# Altium schematic sheet Connector_CU Schematic.SchDoc: Title
size A3; ApprovalDate: dd/mm/yyyy; PartName: RFID_P5 CU board; PageSetup: Record=PageOptions|CenterHorizontal=True|CenterVertical=True|PrintScale=1.01|XCorrection=1.00|YCorrection=1.00|PrintKind=1|BorderSize=5000000|LeftOffset=0|BottomOffset=0|Orientation=2|PaperLength=1000|PaperWidth=1000|Scale=100|PaperSource=7|PrintQuality=600|MediaType=1|DitherType=10|PaperKind=A3 (297 x 420mm)|PrintScaleMode=1; Title2: Connector_CU Schematic; Date: *******; ApprovedBy: *******; CheckedBy: None; Author: *******; CompanyName: *******; DrawnBy: Name; Engineer: *******; Organization: *******; Address1: *******; Address2: *******; Address3: *******; Address4: *******; DocumentNumber: Doc Num; Revision: *******; SheetNumber: 1; SheetTotal: *******; CurrentTime: *******; CurrentDate: *******; Time: *******; DocumentFullPathAndName: *******; DocumentName: *******; ModifiedDate: *******; ImagePath: *******; ProjectName: *******; Application_BuildNumber: *******
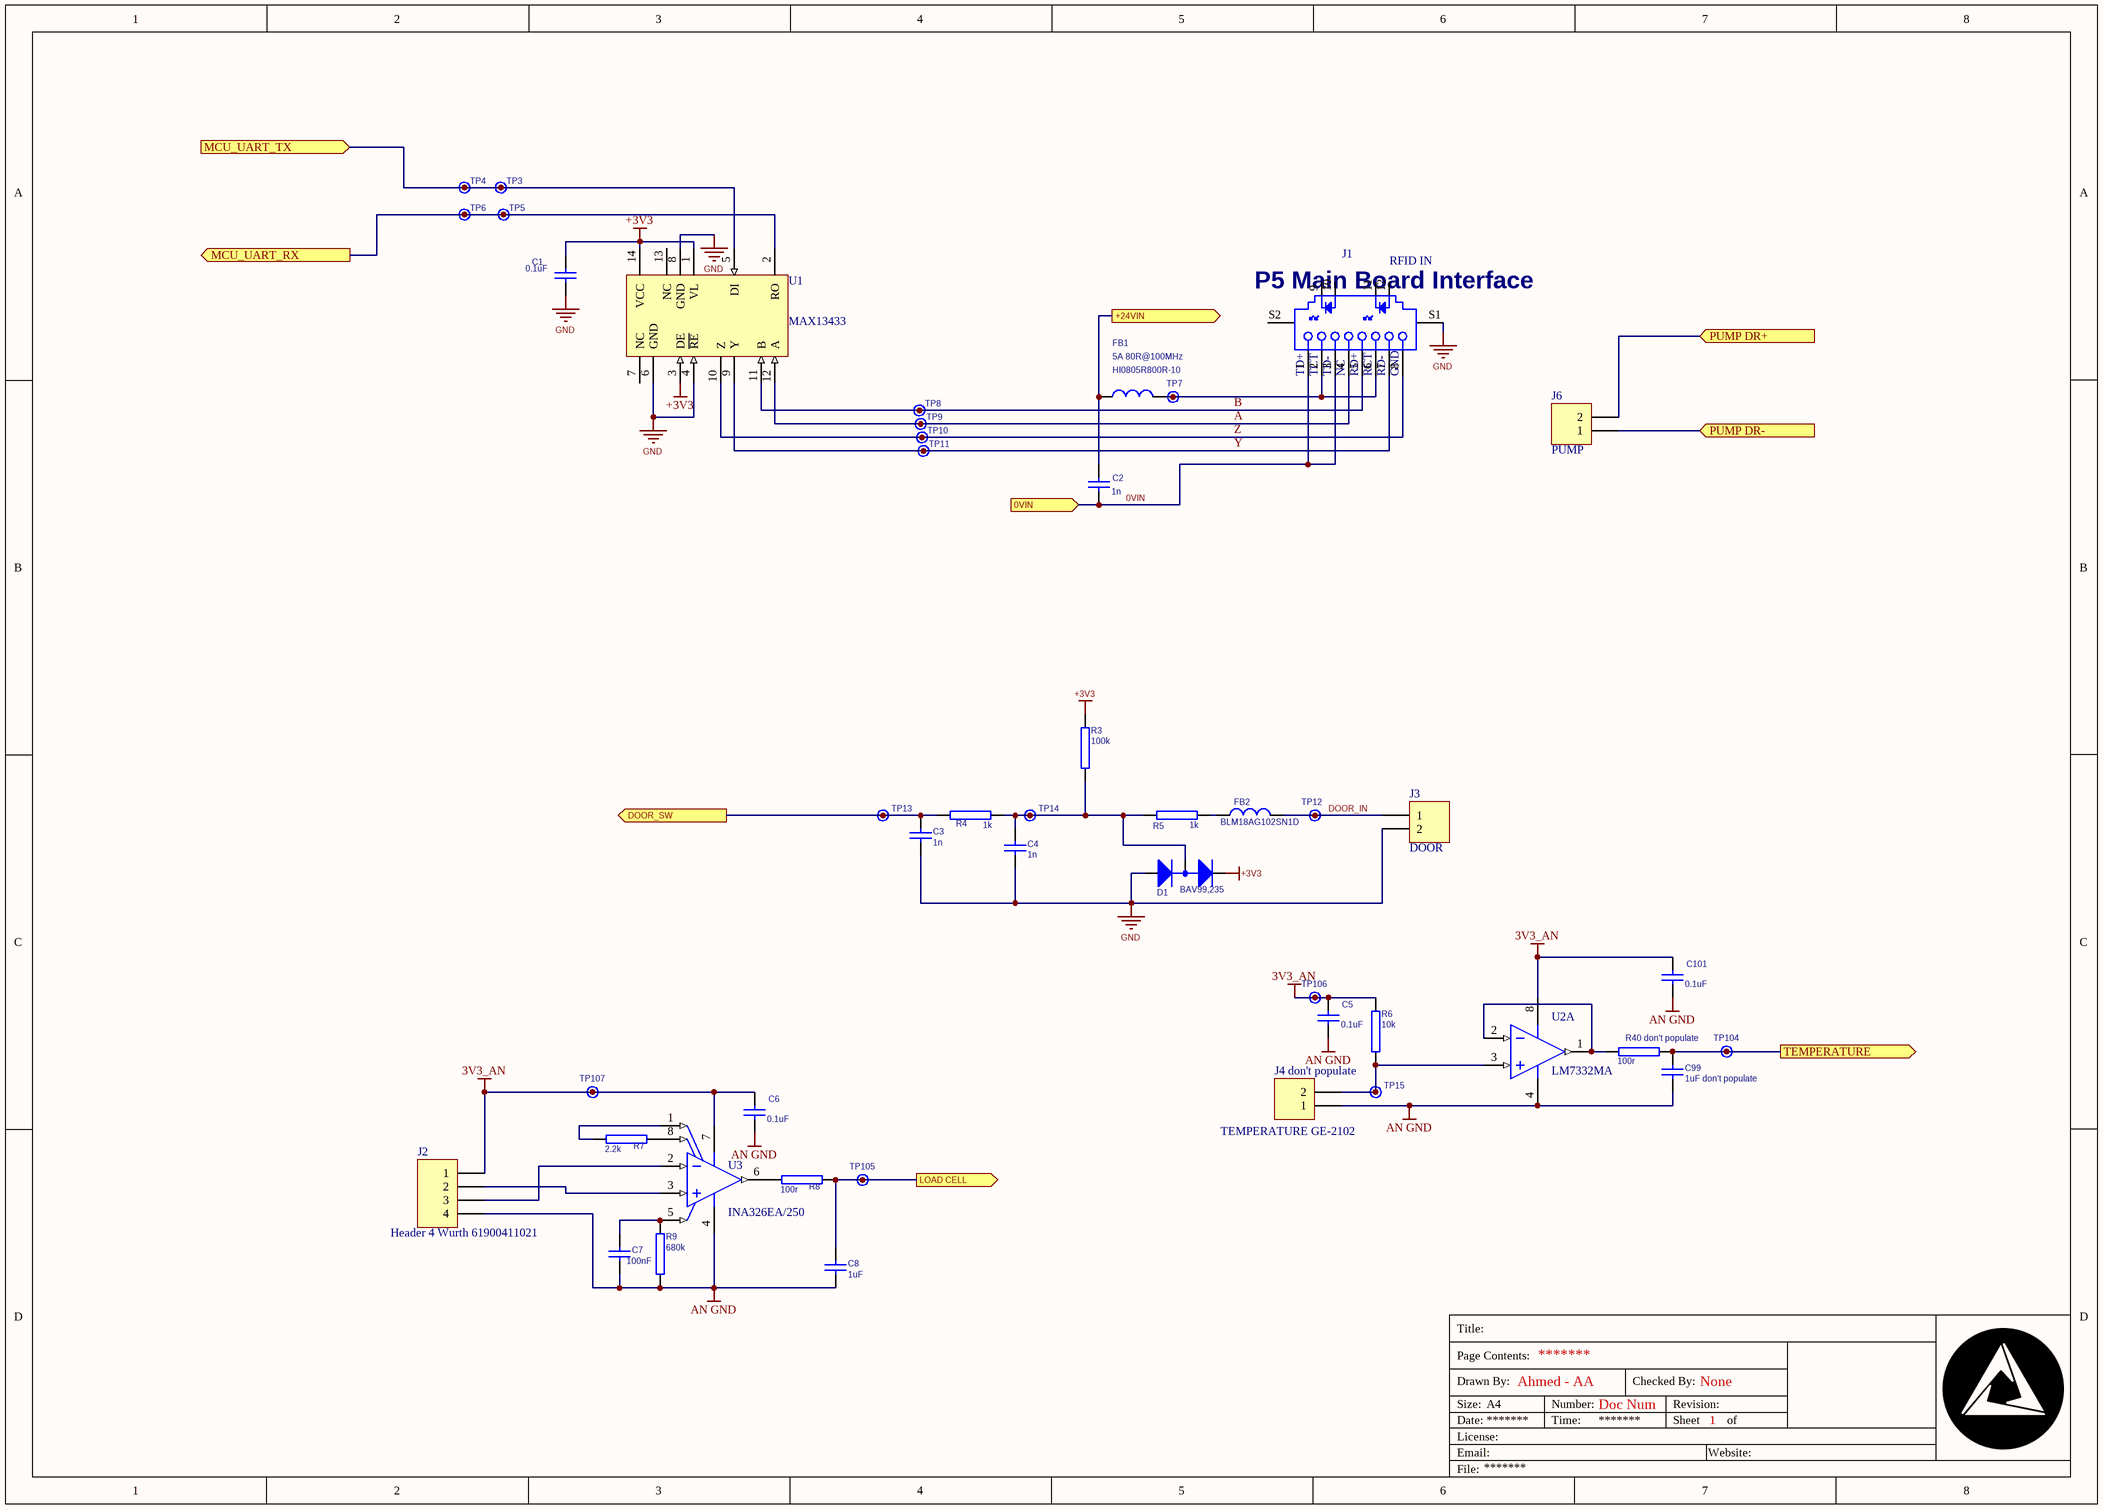
[diagram p0: Connector_CU Schematic.SchDoc]

## Parts
C1  0.1uF  [CAPC1608X09N(0603)]
C2  1n  [CAPC1608X09N(0603)]
C3  1n  [CAPC1608X09N(0603)]
C4  1n  [CAPC1608X09N(0603)]
C5  0.1uF  [CAPC1608X09N(0603)]
C6  0.1uF  [CAPC1608X09N(0603)]
C7  100nF  [CAPC1608X09N(0603)]
C8  1uF  [CAPC1608X09N(0603)]
C99  1uF don't populate  [CAPC1608X09N(0603)]
C101  0.1uF  [CAPC1608X09N(0603)]
D1  BAV99,235  [SOT95P240X130-3N (SOT23-3) DUAL DIODE A_KA_K]
FB1  5A 80R@100MHz  [RESC2012X06N(0805)]
FB2  400mA 1kohm@100MHz  [RESC1608X06N]  (value not drawn)
J1  RFID IN  [AMPH-RJHSE-5381_V]
J2  Header 4 Wurth 61900411021  [S04B-XASS-1N-BN]
J3  DOOR  [S02B-XASS-1]
J4_don't_populate  TEMPERATURE GE-2102  [S02B-XASS-1]
J6  PUMP  [S02B-XASS-1]
R3  100k  [RESC1608X06N(0603)]
R4  1k  [RESC1608X06N(0603)]
R5  1k  [RESC1608X06N(0603)]
R6  10k  [RESC1608X06N(0603)]
R7  2.2k  [RESC1608X06N(0603)]
R8  100r  [RESC1608X06N(0603)]
R9  680k  [RESC1608X06N(0603)]
R40_don't_populate  100r  [RESC1608X06N(0603)]
TP3  LFX_P  [Test Point 1mm]  (value not drawn)  (no BOM)
TP4  LFX_P  [Test Point 1mm]  (value not drawn)  (no BOM)
TP5  LFX_P  [Test Point 1mm]  (value not drawn)  (no BOM)
TP6  LFX_P  [Test Point 1mm]  (value not drawn)  (no BOM)
TP7  LFX_P  [Test Point 1mm]  (value not drawn)  (no BOM)
TP8  LFX_P  [Test Point 1mm]  (value not drawn)  (no BOM)
TP9  LFX_P  [Test Point 1mm]  (value not drawn)  (no BOM)
TP10  LFX_P  [Test Point 1mm]  (value not drawn)  (no BOM)
TP11  LFX_P  [Test Point 1mm]  (value not drawn)  (no BOM)
TP12  LFX_P  [Test Point 1mm]  (value not drawn)  (no BOM)
TP13  LFX_P  [Test Point 1mm]  (value not drawn)  (no BOM)
TP14  LFX_P  [Test Point 1mm]  (value not drawn)  (no BOM)
TP15  LFX_P  [Test Point 1mm]  (value not drawn)  (no BOM)
TP104  LFX_P  [Test Point 1mm]  (value not drawn)  (no BOM)
TP105  LFX_P  [Test Point 1mm]  (value not drawn)  (no BOM)
TP106  LFX_P  [Test Point 1mm]  (value not drawn)  (no BOM)
TP107  LFX_P  [Test Point 1mm]  (value not drawn)  (no BOM)
U1  MAX13433  [S14_M]
U2  LM7332MA  [M08A_N]  (part A of 2)
U3  INA326EA/250  [DGK0008A_L]

## Ports
0VIN (in), +24VIN (out), DOOR_SW (out), LOAD CELL (out), MCU_UART_RX (out), MCU_UART_TX (in), PUMP DR+ (in), PUMP DR- (in), TEMPERATURE (out)

## Nets
3V3_AN: C5.2 C6.2 C101.2 J2.1 R6.2 TP106.TP TP107.TP U2.8(V+) U3.7(V+)
+3V3: C1.2 D1.K2 R3.2 U1.1(VL) U1.3(DE) U1.14(VCC)
AN GND: C5.1 C6.1 C7.2 C8.2 C99.2 C101.1 J2.4 J4_don't_populate.1 R9.1 U2.4(V-) U3.4(V-)
GND: C1.1 C3.2 C4.2 D1.A1 J1.S1 J3.2 U1.4(~{RE}) U1.6(GND) U1.8(GND)
0VIN: C2.1 J1.1 J1.3 ; port 0VIN
+24VIN: C2.2 FB1.1 ; port +24VIN
A: J1.4 TP9.TP U1.12(A)
B: J1.5 TP8.TP U1.11(B)
DOOR_IN: FB2.2 J3.1 TP12.TP
DOOR_SW: C3.1 R4.2 TP13.TP ; port DOOR_SW
LOAD CELL: C8.1 R8.2 TP105.TP ; port LOAD CELL
MCU_UART_RX: TP5.TP TP6.TP U1.2(RO) ; port MCU_UART_RX
MCU_UART_TX: TP3.TP TP4.TP U1.5(DI) ; port MCU_UART_TX
PUMP DR+: J6.2 ; port PUMP DR+
PUMP DR-: J6.1 ; port PUMP DR-
TEMPERATURE: C99.1 R40_don't_populate.2 TP104.TP ; port TEMPERATURE
Y: J1.7 TP11.TP U1.9(Y)
Z: J1.8 TP10.TP U1.10(Z)
NetC4_1: C4.1 D1.K1A2 R3.1 R4.1 R5.2 TP14.TP
NetC7_1: C7.1 R9.2 U3.5(R2)
NetFB1_2: FB1.2 J1.2 J1.6 TP7.TP
NetFB2_1: FB2.1 R5.1
NetJ2_2: J2.2 U3.3(VIN+)
NetJ2_3: J2.3 U3.2(VIN-)
NetJ4_don't_populate_2: J4_don't_populate.2 R6.1 TP15.TP U2.3(INA+)
NetR7_1: R7.1 U3.1(R1)
NetR7_2: R7.2 U3.8(R1)
NetR8_1: R8.1 U3.6(VO)
NetR40_don't_populate_1: R40_don't_populate.1 U2.1(OUTA) U2.2(INA-)

Not connected (* = marked no-connect by the designer): J1 9 10 11 12 S2; U1 7(NC) 13(NC)

## Notes on the sheet
- (near J1) P5 Main Board Interface
- Title:
- Drawn By:
- Page Contents:
- Ahmed - AA
- Checked By:
- Size:
- Date:
- File:
- License:
- Email:
- A4
- Number:
- Time:
- Revision:
- Sheet
- Website:
- of
- (in symbol CMP-2000-06980-1) TD+; TCT; TD-; NC; RD+; RCT; RD-; GND

## Library data of the parts
C1 = GQM1885C1H100JB01D: Capacitor, Ceramic, 50V, ±5%, NP0, -55°C to 125°C; 08 Manufacturer: Murata Electronics North America; 06 Package: 0603; 12 Author: M.Fineschi; 05 Footprint Type: SMD; 02 Part Number: GQM1885C1H100JB01D; 03 Description: Capacitor, Ceramic, 50V, ±5%, NP0, -55°C to 125°C; 04 Value: 0.1uF; 01 Part Category: Capacitor; 09 Digikey PN: 490-3570-1-ND; ComponentLink1Description: Datasheet; ComponentLink1URL: L:\Datasheet\Capacitor\c02e.pdf
C2-C4 C8 C99 = GRM1885C1H102JA01D: Capacitor, Ceramic, 50V, ±5%, C0G NP0, -55°C to 125°C; 08 Manufacturer: Murata Electronics North America; 06 Package: 0603; 12 Author: D.Grace; 05 Footprint Type: SMD; 02 Part Number: GRM1885C1H102JA01D; 03 Description: Capacitor, Ceramic, 50V, ±5%, C0G NP0, -55°C to 125°C; 01 Part Category: Capacitor; 09 Digikey PN: 490-1451-2-ND; ComponentLink1Description: Datasheet; ComponentLink1URL: L:\Datasheet\Capacitor\c02e.pdf
  C2-C4: 04 Value: 1n
  C8 C99: 04 Value: 1uF
C5 C6 C101 = GRM188R71H104KA93D: Capacitor, Ceramic, 50V, ±10%, X7R, -55°C to 125°C; 08 Manufacturer: Murata Electronics North America; 04 Value: 100n; 06 Package: 0603; 12 Author: D.Grace; 05 Footprint Type: SMD; 02 Part Number: GRM188R71H104KA93D; 03 Description: Capacitor, Ceramic, 50V, ±10%, X7R, -55°C to 125°C; 01 Part Category: Capacitor; 09 Digikey PN: 490-1519-2-ND; ComponentLink1Description: Datasheet; ComponentLink1URL: L:\Datasheet\Capacitor\c02e.pdf
C7 = GRM1885C1H102JA01D: Capacitor, Ceramic, 50V, ±5%, C0G NP0, -55°C to 125°C; 08 Manufacturer: Murata Electronics North America; 04 Value: 1n; 06 Package: 0603; 12 Author: D.Grace; 05 Footprint Type: SMD; 02 Part Number: GRM1885C1H102JA01D; 03 Description: Capacitor, Ceramic, 50V, ±5%, C0G NP0, -55°C to 125°C; 01 Part Category: Capacitor; 09 Digikey PN: 490-1451-2-ND; ComponentLink1Description: Datasheet; ComponentLink1URL: L:\Datasheet\Capacitor\c02e.pdf
D1 = BAV99,235: Diodes, Vr = 100V, Io = 215mA, Vf = 1.25V, Tr = 4ns; 01 Part Category: Discreet; 08 Manufacturer: Fairchild Semiconductor; 06 Package: SOT-23-3; 12 Author: D.Grace; 05 Footprint Type: SMD; 02 Part Number: BAV99,235; 03 Description: Diodes, Vr = 100V, Io = 215mA, Vf = 1.25V, Tr = 4ns; 04 Value: BAV99,235; 09 Digikey PN: 568-5005-2-ND; ComponentLink1Description: Datasheet; ComponentLink1URL: L:\Datasheet\Discrete\BAV99_SER.pdf
FB1 = HI0805R800R-10: Ferrite Bead, 80 Ohm @ 100MHz, 5A, DC 10 mOhm Max, -55 °C to 125°C; 01 Part Category: Filter; 08 Manufacturer: Laird-Signal Integrity Products; 06 Package: 0805; 05 Footprint Type: SMD; 12 Author: L.Liu; 03 Description: Ferrite Bead, 80 Ohm @ 100MHz, 5A, DC 10 mOhm Max, -55 °C to 125°C; 04 Value: 80R@100MHz; ComponentLink1Description: Datasheet; ComponentLink1URL: I:\Engineering\Library\Datasheet\Filter\FerriteEMI_ChipBeads_br.pdf; 09 Digikey PN: 240-2395-2-ND; 02 Part Number: HI0805R800R-10
FB2 = BLM18AG102SN1D: Ferrite Bead, 1kohm@100MHz, 400mA, 500mohm, -55 to 125C; 01 Part Category: Filter; 08 Manufacturer: Murata; 06 Package: 0603; 05 Footprint Type: SMD; 12 Author: M.Fineschi; 02 Part Number: BLM18AG102SN1D; 03 Description: Ferrite Bead, 1kohm@100MHz, 400mA, 500mohm, -55 to 125C; 04 Value: 1kohm@100MHz; ComponentLink1Description: Datasheet; ComponentLink1URL: L:\Datasheet\Filter\L0110S0100BLM18A.pdf; 09 Digikey PN: 490-1015-2-ND; 10 Alternate Supplier: BLM18AG102SN1D
J1 = CMP-2000-06980-1: High Speed RJ45, Modular Jack, 8 Position, 8 Contacts, Shielded, with LEDs, -55 to 85 degC,12-Pin THD, RoHS, Tray; Manufacturer: Amphenol; Number of Positions/Contacts: 8p8c(RJ45,Ethernet); Number of Ports: 1; Catalog Drawings: RJ45SeriesRightAngle; PCN Design/Specification: MultipleSeriesCopper29/Jan/2009RJHSEShieldMaterial30/Jun/2015; Other Names: RJHSE5381; Online Catalog: RJHSESeries; Featured Product: ModularJacksProductSolutions; Tab Direction: Up; Shielding: Shielded,EMIFinger; LED Color: Yellow-Green; 3D Model: RJHSE538x.stpRJHSE538x.igs; Category: Connectors,Interconnects; Termination: Solder; Housing Material: Thermoplastic; Mounting Type: ThroughHole; Family: ModularConnectors-Jacks; Orientation: 90°Angle(Right); Features: BoardLock; Contact Material: PhosphorBronze; Mounting Technology: ThroughHole; Number of Rows: 1; Standard Package: 120; Ratings: -; Operating Temperature: -55°C~85°C; Series: RJHSE; Contact Finish: Gold; Package Reference: RJHSE-5381; Ingress Protection: -; Package Description: 12-Pin Through Hole Device, Body 16.51 x 15.75 mm; Contact Finish Thickness: 50µin(1.27µm); Datasheet URL: https://datasheet.ciiva.com/16481/rjhse538x-16481714.pdf; Datasheet Version: Rev. K, 04/2014; Connector Type: Jack; Manufacturer URL: http://www.amphenol.com/; Packaging: Tray
J2 = Header 4: Header, 4-Pin; LatestRevisionDate: 17-Jul-2002; LatestRevisionNote: Re-released for DXP Platform.; Publisher: Altium Limited
J3 J4_don't_populate J6 = Header 2: Header, 2-Pin; LatestRevisionDate: 17-Jul-2002; LatestRevisionNote: Re-released for DXP Platform.; Publisher: Altium Limited
R3 = RC0603FR-07100KL: Resistor, Thick Film, 0.1W, ±1%, ±100ppm/°C; 08 Manufacturer: Yageo; 13 Reviewed By: P.Moutzouris; 06 Package: 0603; 12 Author: D.Grace; 05 Footprint Type: SMD; 02 Part Number: RC0603FR-07100KL; 03 Description: Resistor, Thick Film, 0.1W, ±1%, ±100ppm/°C; 04 Value: 100k; 09 Digikey PN: 311-100KHRTR-ND; 01 Part Category: Resistor; ComponentLink1Description: Datasheet; ComponentLink1URL: L:\Datasheet\Resistor\PYu-RC0603_51_RoHS_L_4.pdf
R4 R5 = RC0603FR-071KL: Resistor, Thick Film, 0.1W, ±1%, ±100ppm/°C; 08 Manufacturer: Yageo; 13 Reviewed By: P.Moutzouris; 06 Package: 0603; 12 Author: D.Grace; 05 Footprint Type: SMD; 02 Part Number: RC0603FR-071KL; 03 Description: Resistor, Thick Film, 0.1W, ±1%, ±100ppm/°C; 04 Value: 1k; 09 Digikey PN: 311-1.00KHRTR-ND; 01 Part Category: Resistor; ComponentLink1Description: Datasheet; ComponentLink1URL: L:\Datasheet\Resistor\PYu-RC0603_51_RoHS_L_4.pdf
R6 = RC0603FR-07100KL: Resistor, Thick Film, 0.1W, ±1%, ±100ppm/°C; 08 Manufacturer: Yageo; 13 Reviewed By: P.Moutzouris; 04 Value: 100k; 06 Package: 0603; 12 Author: D.Grace; 05 Footprint Type: SMD; 02 Part Number: RC0603FR-07100KL; 03 Description: Resistor, Thick Film, 0.1W, ±1%, ±100ppm/°C; 09 Digikey PN: 311-100KHRTR-ND; 01 Part Category: Resistor; ComponentLink1Description: Datasheet; ComponentLink1URL: L:\Datasheet\Resistor\PYu-RC0603_51_RoHS_L_4.pdf
R7 = CMP-007-0038-1: Resistor, Thick Film, 0.1W, ±1%, ±100ppm/°C; 02 Part Number: RC0603FR-071KL; 08 Manufacturer: Yageo; 13 Reviewed By: P.Moutzouris; 04 Value: 1k; 06 Package: 0603; 12 Author: D.Grace; 05 Footprint Type: SMD; 03 Description: Resistor, Thick Film, 0.1W, ±1%, ±100ppm/°C; 09 Digikey PN: 311-1.00KHRTR-ND; 01 Part Category: Resistor; ComponentLink1Description: Datasheet; ComponentLink1URL: L:\Datasheet\Resistor\PYu-RC0603_51_RoHS_L_4.pdf; Component Name: RC0603FR-071KL
R8 R9 R40_don't_populate = CMP-007-0038-1: Resistor, Thick Film, 0.1W, ±1%, ±100ppm/°C; 02 Part Number: RC0603FR-071KL; 08 Manufacturer: Yageo; 13 Reviewed By: P.Moutzouris; 06 Package: 0603; 12 Author: D.Grace; 05 Footprint Type: SMD; 03 Description: Resistor, Thick Film, 0.1W, ±1%, ±100ppm/°C; 09 Digikey PN: 311-1.00KHRTR-ND; 01 Part Category: Resistor; ComponentLink1Description: Datasheet; ComponentLink1URL: L:\Datasheet\Resistor\PYu-RC0603_51_RoHS_L_4.pdf; Component Name: RC0603FR-071KL
  R8 R40_don't_populate: 04 Value: 100r
  R9: 04 Value: 680k
TP3-TP15 TP104-TP107 = Test Point: 01 Part Category: PCB; 12 Author: D.Grace
U1 = CMP-1344-00010-1: RS485/RS422 Transceiver, Fault Protected +/- 60 V, 3 to 5.5 V, 0 to 70 degC, 14-Pin SOIC (S-14), RoHS, Tube; Manufacturer: Linear Technology; Duplex: Full; Receiver Hysteresis: 25 mV; Fault Protected: +/- 60 V; Drivers: 1; fMAX: 250 kbps Min.; ComponentLink2URL: http://cds.linear.com/docs/en/datasheet/2862345fc.pdf; Mounting Technology: Surface Mount; ComponentLink3Description: Package Specification; RoHS: TRUE; Temperature Range: 0 to 70 degC; Packing: Tube; PartNumber: MAX13433; PackageVersion: Rev. G; ComponentLink1Description: Manufacturer URL; ComponentLink2Description: Datasheet; DatasheetVersion: Rev. C; ComponentLink3URL: http://cds.linear.com/docs/en/packaging/05081610_G_S14.pdf; VCC: 3 to 5.5 V; ComponentLink1URL: http://www.linear.com/; PackageDescription: 14-Pin Plastic Small Outline, Body 8.65 x 3.9 mm, Pitch 1.27 mm
U2 = CMP-0055-00649-2: Dual Rail-to-Rail Input/Output, 30V, Wide Voltage Range, High Output Operational Amplifier, 8-pin Narrow SOIC; Manufacturer: National Semiconductor; CompType: Amplifiers; PackageTopMarking: NSZXTT*LM733*2MA; PowerWise: N; DatasheetVersion: Apr-2008; ComponentLink1URL: http://www.national.com/ds/LM/LM7332.pdf; RevisionNote: Component URLs added; PackageVersion: revM, May-2009; PinCount: 8; PackageReference: M08A; Code_JEDEC: MS-012-AA; RoHS: Y; ComponentLink1Description: LM7332 Datasheet; ComponentLink3URL: http://www.national.com/packaging/folders/m08a.html; ComponentLink3Description: M08A Package Page; PackageDescription: SOIC Narrow, 4.9 x 3.9 x 1.45mm, 8 Lead, 1.27mm Pitch; ComponentLink2Description: LM7332 Web Page; ComponentLink2URL: http://www.national.com/pf/LM/LM7332.html; Code_IPC: SOIC127P600-8
U3 = CMP-0944-00051-2: Precision, Low Drift, CMOS Instrumentation Amplifier, -40 to 85 degC, 8-pin SOP (DGK8), Green (RoHS & no Sb/Br); Manufacturer: Texas Instruments; SubFamily: Single Supply; Quiescent Current (+/-)(Typ)(mA): 2.4; Vs(Min)(V): 2.7; Gain(V/V): Less than 0.1 to Greater than 1000; Non-Linearity (+/-)(Max)(%): 0.01; Number of Channels: 1; Input Bias Current (+/-)(Max)(nA): 2; Input Offset Drift (+/-)(Max)(uV/Degrees Celsius): 0.4; Vs(Max)(V): 5.5; CMRR(Min)(dB): 100; Noise at 1kHz(Typ)(nV/rt(Hz)): 33; Eco-Plan: Green (RoHS & no Sb/Br); Code_JEDEC: MO-187; PackageVersion: 4073329/E, 05/2006; PackageDescription: 8-Pin Thin Small Outline, Body 3 x 3 mm, Pitch 0.65 mm; ComponentLink3Description: Package Specification; ComponentLink3URL: http://www.ti.com/litv/pdf/mpds028d; ComponentLink2URL: http://www.ti.com/general/docs/lit/getliterature.tsp?genericPartNumber=INA326&fileType=pdf; PartNumber: INA326EA/250; DatasheetVersion: SBOS222D; PackageReference: DGK0008A; ComponentLink1URL: http://www.ti.com/; ComponentLink1Description: Manufacturer URL; ComponentLink2Description: Datasheet; Mounting Technology: Surface Mount; Input Offset (+/-)(Max)(uV): 100